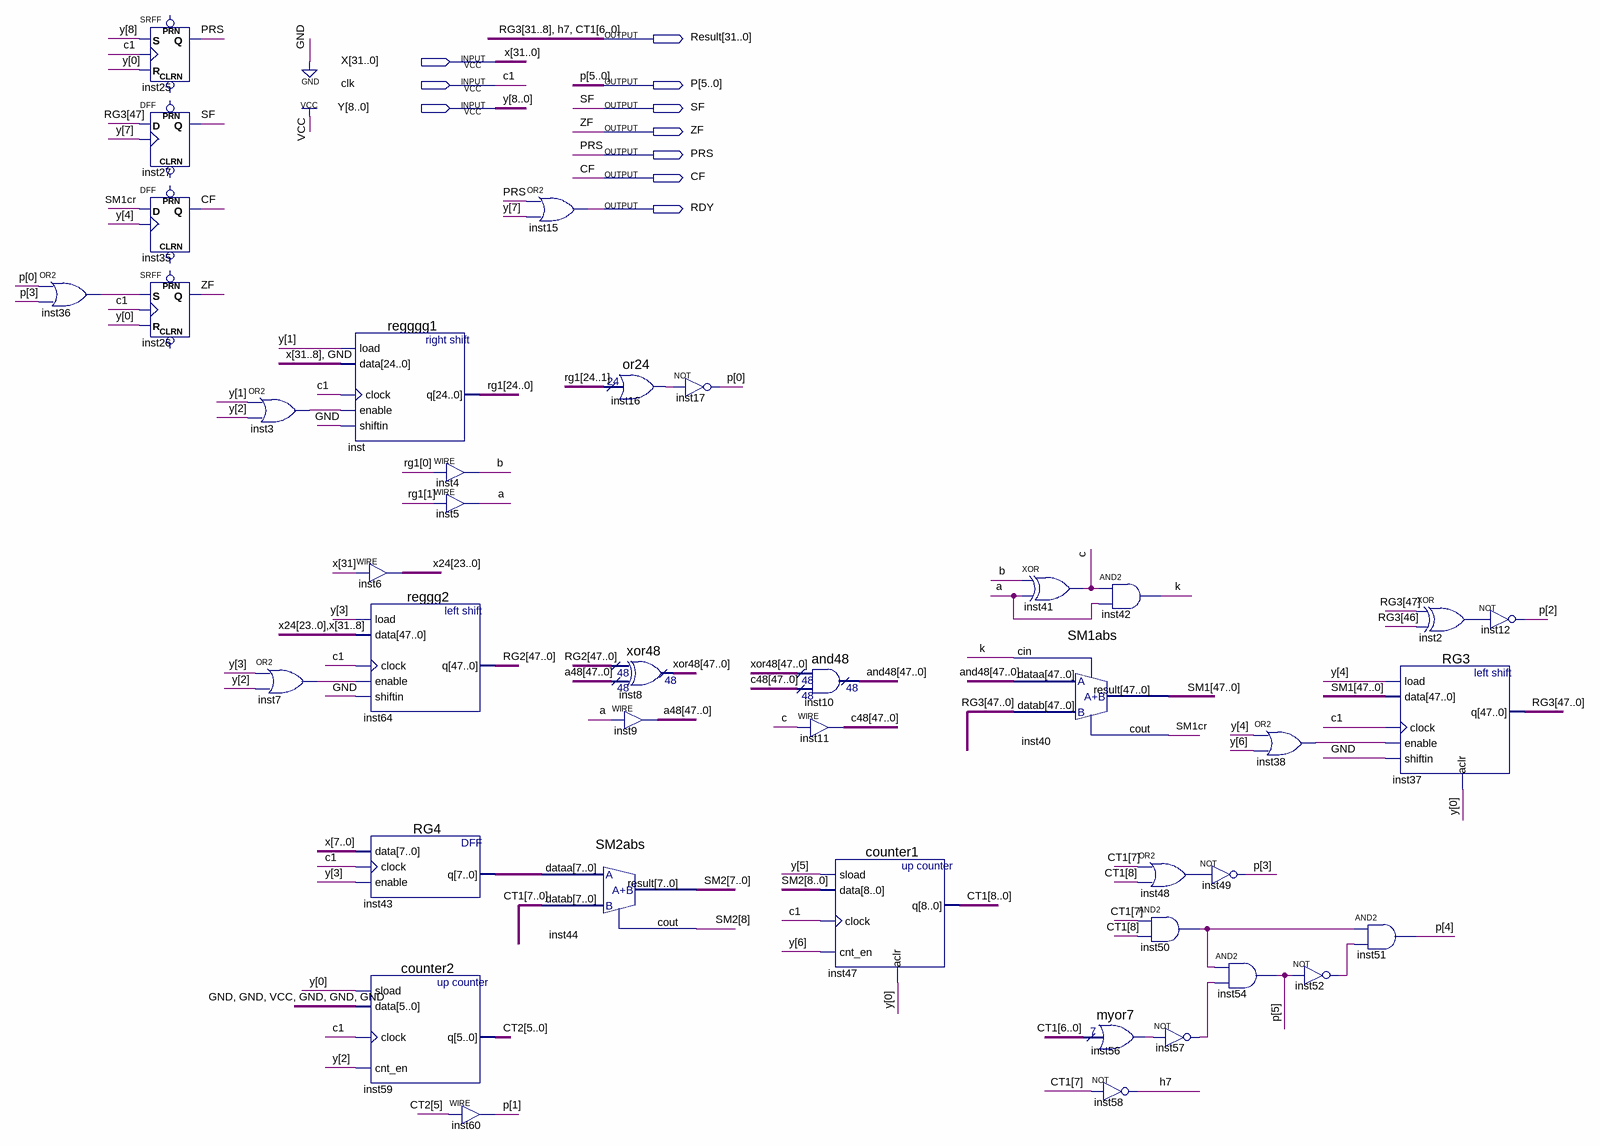
[diagram p0: schematic sheet]
// Quartus schematic Ob.bdf as structural Verilog: 40 symbols, 10 pins
module Ob (
  input  [31:0] X,
  input  clk,
  input  [8:0] Y,
  output [31:0] Result,
  output [5:0] P,
  output SF,
  output ZF,
  output PRS,
  output CF,
  output RDY
);

  wire a, b, c, inst2_out, inst3_out, inst7_out, inst16_result, inst36_out, inst38_out, inst48_out,
       inst50_out, inst52_out, inst56_result, inst57_out, k, SM1cr;
  wire [5:0] CT2;
  wire [7:0] inst43_q;
  wire [8:0] SM2;
  wire [8:7] CT1;
  wire [23:0] x24;
  wire [24:0] rg1;
  wire [47:0] a48, and48, c48, RG2, RG3, SM1, xor48;

  or inst36 (inst36_out, P[0], P[3]);
  SRFF inst25 (.S(Y[8]), .R(Y[0]), .CLK(clk), .Q(PRS));  // open: PRN, CLRN
  DFF inst27 (.CLK(Y[7]), .D(RG3[47]), .Q(SF));  // open: CLRN, PRN
  DFF inst35 (.CLK(Y[4]), .D(SM1cr), .Q(CF));  // open: CLRN, PRN
  SRFF inst26 (.S(inst36_out), .R(Y[0]), .CLK(clk), .Q(ZF));  // open: PRN, CLRN
  or inst3 (inst3_out, Y[1], Y[2]);
  or inst7 (inst7_out, Y[3], Y[2]);
  regggg1 inst (.load(Y[1]), .data({X[31:8], 1'b0}), .clock(clk), .enable(inst3_out), .shiftin(1'b0), .q(rg1));
  assign x24 = {24{X[31]}};  // WIRE inst6
  reggg2 inst64 (.load(Y[3]), .data({x24, X[31:8]}), .clock(clk), .enable(inst7_out), .shiftin(1'b0), .q(RG2));
  RG4 inst43 (.data(X[7:0]), .clock(clk), .enable(Y[3]), .q(inst43_q));
  counter2 inst59 (.sload(Y[0]), .data(6'b001000), .clock(clk), .cnt_en(Y[2]), .q(CT2));
  assign b = rg1[0];  // WIRE inst4
  assign a = rg1[1];  // WIRE inst5
  assign P[1] = CT2[5];  // WIRE inst60
  or inst15 (RDY, PRS, Y[7]);
  SM2abs inst44 (.dataa(inst43_q), .datab({CT1[7], Result[6:0]}), .result(SM2[7:0]), .cout(SM2[8]));
  or24 inst16 (.data(rg1[24:1]), .result(inst16_result));
  xor48 inst8 (.data0x(RG2), .data1x(a48), .result(xor48));
  assign a48 = {48{a}};  // WIRE inst9
  not inst17 (P[0], inst16_result);
  and48 inst10 (.data0x(xor48), .data1x(c48), .result(and48));
  assign c48 = {48{c}};  // WIRE inst11
  counter1 inst47 (.sload(Y[5]), .data(SM2), .clock(clk), .cnt_en(Y[6]), .aclr(Y[0]), .q({CT1, Result[6:0]}));
  xor inst41 (c, b, a);
  SM1abs inst40 (.dataa(and48), .datab({RG3[47:32], Result[31:8], RG3[7:0]}), .cin(k), .result(SM1), .cout(SM1cr));
  and inst42 (k, c, a);
  myor7 inst56 (.data(Result[6:0]), .result(inst56_result));
  not inst58 (Result[7], CT1[7]);
  or inst48 (inst48_out, CT1[7], CT1[8]);
  and inst50 (inst50_out, CT1[7], CT1[8]);
  not inst57 (inst57_out, inst56_result);
  not inst49 (P[3], inst48_out);
  and inst54 (P[5], inst50_out, inst57_out);
  or inst38 (inst38_out, Y[4], Y[6]);
  not inst52 (inst52_out, P[5]);
  RG3 inst37 (
    .load(Y[4]), .data(SM1), .clock(clk), .enable(inst38_out), .shiftin(1'b0), .aclr(Y[0]),
    .q({RG3[47:32], Result[31:8], RG3[7:0]}));
  and inst51 (P[4], inst50_out, inst52_out);
  xor inst2 (inst2_out, RG3[47], RG3[46]);
  not inst12 (P[2], inst2_out);

  // Other names for the same wires on the sheet: c1 = clk; CT1[6:0] = Result[6:0]; h7 = Result[7];
  //   RG3[31:8] = Result[31:8]
endmodule
